# Altium schematic sheet Sheet2.SchDoc
size A4
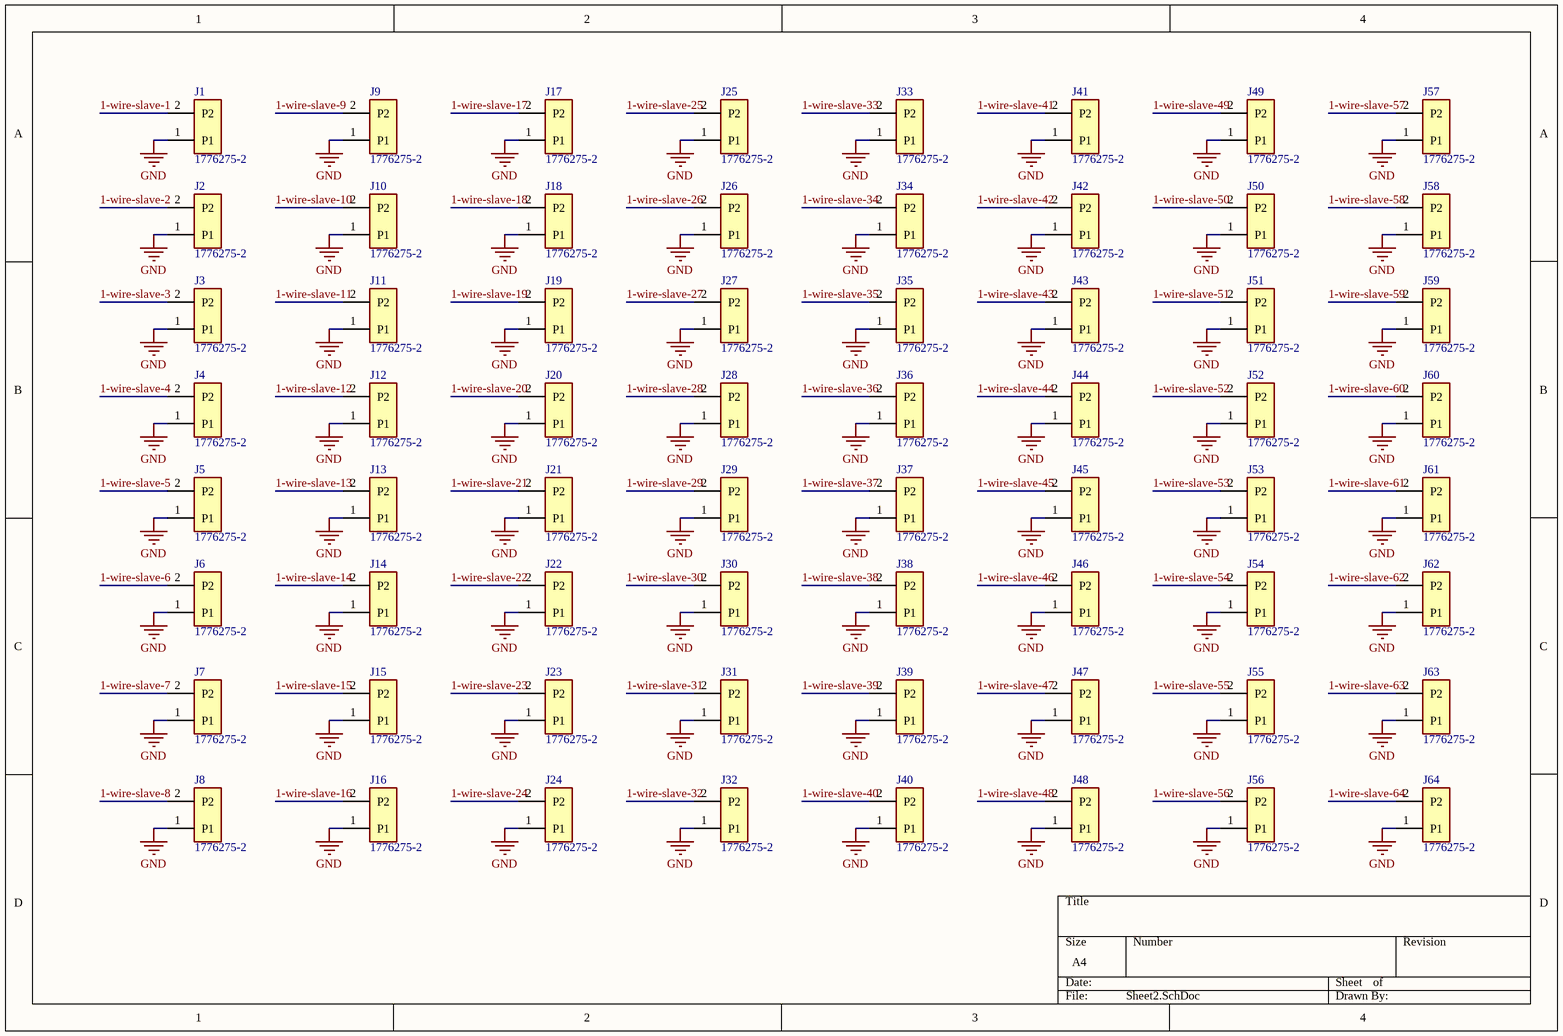
[diagram p0: Sheet2.SchDoc]

## Parts
J1  1776275-2  [TE_1776275-2]
J2  1776275-2  [TE_1776275-2]
J3  1776275-2  [TE_1776275-2]
J4  1776275-2  [TE_1776275-2]
J5  1776275-2  [TE_1776275-2]
J6  1776275-2  [TE_1776275-2]
J7  1776275-2  [TE_1776275-2]
J8  1776275-2  [TE_1776275-2]
J9  1776275-2  [TE_1776275-2]
J10  1776275-2  [TE_1776275-2]
J11  1776275-2  [TE_1776275-2]
J12  1776275-2  [TE_1776275-2]
J13  1776275-2  [TE_1776275-2]
J14  1776275-2  [TE_1776275-2]
J15  1776275-2  [TE_1776275-2]
J16  1776275-2  [TE_1776275-2]
J17  1776275-2  [TE_1776275-2]
J18  1776275-2  [TE_1776275-2]
J19  1776275-2  [TE_1776275-2]
J20  1776275-2  [TE_1776275-2]
J21  1776275-2  [TE_1776275-2]
J22  1776275-2  [TE_1776275-2]
J23  1776275-2  [TE_1776275-2]
J24  1776275-2  [TE_1776275-2]
J25  1776275-2  [TE_1776275-2]
J26  1776275-2  [TE_1776275-2]
J27  1776275-2  [TE_1776275-2]
J28  1776275-2  [TE_1776275-2]
J29  1776275-2  [TE_1776275-2]
J30  1776275-2  [TE_1776275-2]
J31  1776275-2  [TE_1776275-2]
J32  1776275-2  [TE_1776275-2]
J33  1776275-2  [TE_1776275-2]
J34  1776275-2  [TE_1776275-2]
J35  1776275-2  [TE_1776275-2]
J36  1776275-2  [TE_1776275-2]
J37  1776275-2  [TE_1776275-2]
J38  1776275-2  [TE_1776275-2]
J39  1776275-2  [TE_1776275-2]
J40  1776275-2  [TE_1776275-2]
J41  1776275-2  [TE_1776275-2]
J42  1776275-2  [TE_1776275-2]
J43  1776275-2  [TE_1776275-2]
J44  1776275-2  [TE_1776275-2]
J45  1776275-2  [TE_1776275-2]
J46  1776275-2  [TE_1776275-2]
J47  1776275-2  [TE_1776275-2]
J48  1776275-2  [TE_1776275-2]
J49  1776275-2  [TE_1776275-2]
J50  1776275-2  [TE_1776275-2]
J51  1776275-2  [TE_1776275-2]
J52  1776275-2  [TE_1776275-2]
J53  1776275-2  [TE_1776275-2]
J54  1776275-2  [TE_1776275-2]
J55  1776275-2  [TE_1776275-2]
J56  1776275-2  [TE_1776275-2]
J57  1776275-2  [TE_1776275-2]
J58  1776275-2  [TE_1776275-2]
J59  1776275-2  [TE_1776275-2]
J60  1776275-2  [TE_1776275-2]
J61  1776275-2  [TE_1776275-2]
J62  1776275-2  [TE_1776275-2]
J63  1776275-2  [TE_1776275-2]
J64  1776275-2  [TE_1776275-2]

## Nets
GND: J1.1(P1) J2.1(P1) J3.1(P1) J4.1(P1) J5.1(P1) J6.1(P1) J7.1(P1) J8.1(P1) J9.1(P1) J10.1(P1) J11.1(P1) J12.1(P1) J13.1(P1) J14.1(P1) J15.1(P1) J16.1(P1) J17.1(P1) J18.1(P1) J19.1(P1) J20.1(P1) J21.1(P1) J22.1(P1) J23.1(P1) J24.1(P1) J25.1(P1) J26.1(P1) J27.1(P1) J28.1(P1) J29.1(P1) J30.1(P1) J31.1(P1) J32.1(P1) J33.1(P1) J34.1(P1) J35.1(P1) J36.1(P1) J37.1(P1) J38.1(P1) J39.1(P1) J40.1(P1) J41.1(P1) J42.1(P1) J43.1(P1) J44.1(P1) J45.1(P1) J46.1(P1) J47.1(P1) J48.1(P1) J49.1(P1) J50.1(P1) J51.1(P1) J52.1(P1) J53.1(P1) J54.1(P1) J55.1(P1) J56.1(P1) J57.1(P1) J58.1(P1) J59.1(P1) J60.1(P1) J61.1(P1) J62.1(P1) J63.1(P1) J64.1(P1)
1-wire-slave-1: J1.2(P2)
1-wire-slave-2: J2.2(P2)
1-wire-slave-3: J3.2(P2)
1-wire-slave-4: J4.2(P2)
1-wire-slave-5: J5.2(P2)
1-wire-slave-6: J6.2(P2)
1-wire-slave-7: J7.2(P2)
1-wire-slave-8: J8.2(P2)
1-wire-slave-9: J9.2(P2)
1-wire-slave-10: J10.2(P2)
1-wire-slave-11: J11.2(P2)
1-wire-slave-12: J12.2(P2)
1-wire-slave-13: J13.2(P2)
1-wire-slave-14: J14.2(P2)
1-wire-slave-15: J15.2(P2)
1-wire-slave-16: J16.2(P2)
1-wire-slave-17: J17.2(P2)
1-wire-slave-18: J18.2(P2)
1-wire-slave-19: J19.2(P2)
1-wire-slave-20: J20.2(P2)
1-wire-slave-21: J21.2(P2)
1-wire-slave-22: J22.2(P2)
1-wire-slave-23: J23.2(P2)
1-wire-slave-24: J24.2(P2)
1-wire-slave-25: J25.2(P2)
1-wire-slave-26: J26.2(P2)
1-wire-slave-27: J27.2(P2)
1-wire-slave-28: J28.2(P2)
1-wire-slave-29: J29.2(P2)
1-wire-slave-30: J30.2(P2)
1-wire-slave-31: J31.2(P2)
1-wire-slave-32: J32.2(P2)
1-wire-slave-33: J33.2(P2)
1-wire-slave-34: J34.2(P2)
1-wire-slave-35: J35.2(P2)
1-wire-slave-36: J36.2(P2)
1-wire-slave-37: J37.2(P2)
1-wire-slave-38: J38.2(P2)
1-wire-slave-39: J39.2(P2)
1-wire-slave-40: J40.2(P2)
1-wire-slave-41: J41.2(P2)
1-wire-slave-42: J42.2(P2)
1-wire-slave-43: J43.2(P2)
1-wire-slave-44: J44.2(P2)
1-wire-slave-45: J45.2(P2)
1-wire-slave-46: J46.2(P2)
1-wire-slave-47: J47.2(P2)
1-wire-slave-48: J48.2(P2)
1-wire-slave-49: J49.2(P2)
1-wire-slave-50: J50.2(P2)
1-wire-slave-51: J51.2(P2)
1-wire-slave-52: J52.2(P2)
1-wire-slave-53: J53.2(P2)
1-wire-slave-54: J54.2(P2)
1-wire-slave-55: J55.2(P2)
1-wire-slave-56: J56.2(P2)
1-wire-slave-57: J57.2(P2)
1-wire-slave-58: J58.2(P2)
1-wire-slave-59: J59.2(P2)
1-wire-slave-60: J60.2(P2)
1-wire-slave-61: J61.2(P2)
1-wire-slave-62: J62.2(P2)
1-wire-slave-63: J63.2(P2)
1-wire-slave-64: J64.2(P2)

## Library data of the parts
J1-J64 = 1776275-2: TERM BLOCK 2POS SIDE ENT 3.5MM; MF: {'manufacturer': u'TE Connectivity'}; Value: *; MP: 1776275-2; Availability: Unavailable; Price: None; Package: None